# Altium project ECE453-F22-MCU.PrjPcb (part 2 of 2)

## Sheet StepperDriver.SchDoc
size A
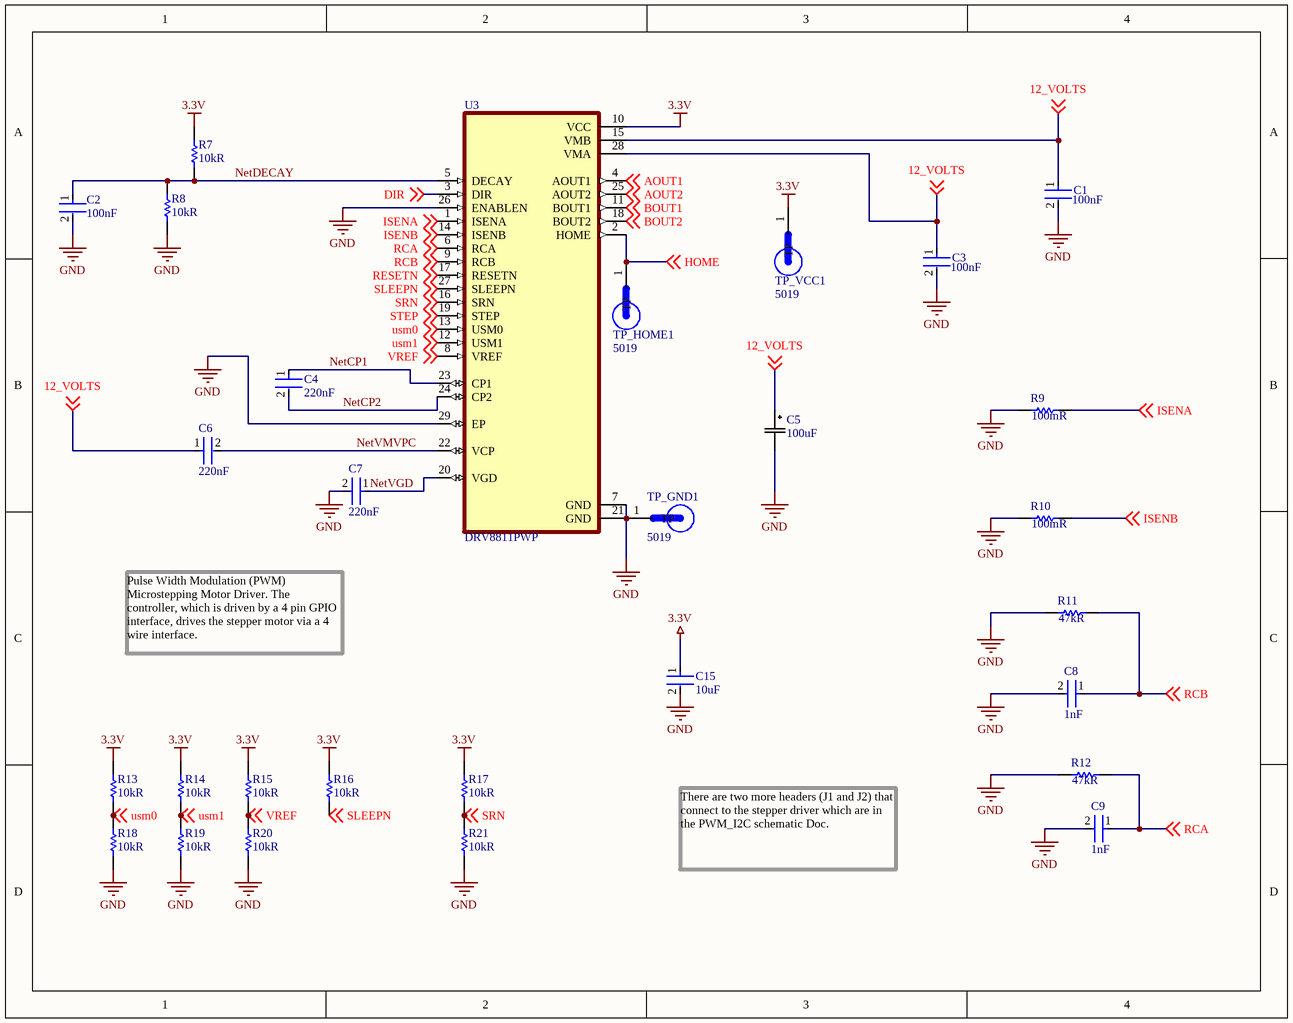
[diagram p3: StepperDriver.SchDoc]

### Parts
C1  Capacitance: 100nF  [FP-CL21-IPC_C]  (hidden comment: CL21B104KACNNNC)
C2  Capacitance: 100nF  [FP-CL21-IPC_C]  (hidden comment: CL21B104KACNNNC)
C3  Capacitance: 100nF  [FP-CL21-IPC_C]  (hidden comment: CL21B104KACNNNC)
C4  Capacitance: 220nF  [FP-0805-L_2_0_0_1-W_1_25-IPC_A]  (hidden comment: UMK212B7224KG-T)
C5  Capacitance: 100uF  [CAP_PC_8X7_NCH]  (hidden comment: PCV1D101MCL2GS)
C6  Capacitance: 220nF  [FP-0805-L_2_0_0_1-W_1_25-IPC_A]  (hidden comment: UMK212B7224KG-T)
C7  Capacitance: 220nF  [FP-0805-L_2_0_0_1-W_1_25-IPC_A]  (hidden comment: UMK212B7224KG-T)
C8  Capacitance: 1nF  [FP-0805-L_2_01_0_2-W_1_25-IPC_C]  (hidden comment: 08055C102KAT2A)
C9  Capacitance: 1nF  [FP-0805-L_2_01_0_2-W_1_25-IPC_C]  (hidden comment: 08055C102KAT2A)
C15  value 10uF  [FP-C0805C-DG-MFG]  (hidden comment: C0805C106K8PACTU)
R7  Resistance: 10kR  [RESC2013X60X35NL10T20]  (hidden comment: RC0805FR-0710KL)
R8  Resistance: 10kR  [RESC2013X60X35NL10T20]  (hidden comment: RC0805FR-0710KL)
R9  Resistance: 100mR  [RESC2013X65X35ML10T20]  (hidden comment: PT0805FR-7W0R1L)
R10  Resistance: 100mR  [RESC2013X65X35ML10T20]  (hidden comment: PT0805FR-7W0R1L)
R11  Resistance: 47kR  [RESC2013X70X40ML20T20]  (hidden comment: ERJ-6GEYJ473V)
R12  Resistance: 47kR  [RESC2013X70X40ML20T20]  (hidden comment: ERJ-6GEYJ473V)
R13  Resistance: 10kR  [RESC2013X60X35NL10T20]  (hidden comment: RC0805FR-0710KL)
R14  Resistance: 10kR  [RESC2013X60X35NL10T20]  (hidden comment: RC0805FR-0710KL)
R15  Resistance: 10kR  [RESC2013X60X35NL10T20]  (hidden comment: RC0805FR-0710KL)
R16  Resistance: 10kR  [RESC2013X60X35NL10T20]  (hidden comment: RC0805FR-0710KL)
R17  Resistance: 10kR  [RESC2013X60X35NL10T20]  (hidden comment: RC0805FR-0710KL)
R18  Resistance: 10kR  [RESC2013X60X35NL10T20]  (hidden comment: RC0805FR-0710KL)
R19  Resistance: 10kR  [RESC2013X60X35NL10T20]  (hidden comment: RC0805FR-0710KL)
R20  Resistance: 10kR  [RESC2013X60X35NL10T20]  (hidden comment: RC0805FR-0710KL)
R21  Resistance: 10kR  [RESC2013X60X35NL10T20]  (hidden comment: RC0805FR-0710KL)
TP_GND1  5019  [TP380X203]
TP_HOME1  5019  [TP380X203]
TP_VCC1  5019  [TP380X203]
U3  DRV8811PWP  [IC_TPS61196PWPRQ1]

### Nets
3.3V: C15.1 R7.2 R13.2 R14.2 R15.2 R16.2 R17.2 TP_VCC1.1(TP) U3.10(VCC)
GND: C1.2 C2.2 C3.2 C5.2 C7.2 C8.2 C9.2 C15.2 R8.1 R9.1 R10.1 R11.1 R12.1 R18.1 R19.1 R20.1 R21.1 TP_GND1.1(TP) U3.7(GND) U3.21(GND) U3.26(ENABLEN) U3.29(EP)
12_VOLTS: C1.1 C3.1 C5.1 C6.1 U3.15(VMB) U3.28(VMA) ; off-sheet 12_VOLTS
AOUT1: U3.4(AOUT1) ; off-sheet AOUT1
AOUT2: U3.25(AOUT2) ; off-sheet AOUT2
BOUT1: U3.11(BOUT1) ; off-sheet BOUT1
BOUT2: U3.18(BOUT2) ; off-sheet BOUT2
DIR: U3.3(DIR) ; off-sheet DIR
HOME: TP_HOME1.1(TP) U3.2(HOME) ; off-sheet HOME
ISENA: R9.2 U3.1(ISENA) ; off-sheet ISENA
ISENB: R10.2 U3.14(ISENB) ; off-sheet ISENB
NetCP1: C4.1 U3.23(CP1)
NetCP2: C4.2 U3.24(CP2)
NetDECAY: C2.1 R7.1 R8.2 U3.5(DECAY)
NetVGD: C7.1 U3.20(VGD)
NetVMVPC: C6.2 U3.22(VCP)
RCA: C9.1 R12.2 U3.6(RCA) ; off-sheet RCA
RCB: C8.1 R11.2 U3.9(RCB) ; off-sheet RCB
RESETN: U3.17(RESETN) ; off-sheet RESETN
SLEEPN: R16.1 U3.27(SLEEPN) ; off-sheet SLEEPN
SRN: R17.1 R21.2 U3.16(SRN) ; off-sheet SRN
STEP: U3.19(STEP) ; off-sheet STEP
usm0: R13.1 R18.2 U3.13(USM0) ; off-sheet usm0
usm1: R14.1 R19.2 U3.12(USM1) ; off-sheet usm1
VREF: R15.1 R20.2 U3.8(VREF) ; off-sheet VREF

### Notes on the sheet
- Pulse Width Modulation (PWM) Microstepping Motor Driver. The controller, which is driven by a 4 pin GPIO interface, drives the stepper motor via a 4 wire interface.
- There are two more headers (J1 and J2) that connect to the stepper driver which are in the PWM_I2C schematic Doc.

### Library data of the parts
C1-C3 = CMP-13271-002854-1: CL21 Series 0805 100nF 25V ±10% Tolerance X7R Multilayer Ceramic Chip Capacitor; Manufacturer: Samsung; Thickness: 0.037inch; Dielectric: X7R; Packaging: Tape and Reel; Height: 0.85mm; Case/Package: 0805; Mount: Surface Mount; Case Code (Imperial): 0805; Case Code (Metric): 2012; Length: 2mm; Voltage Rating: 25V; Voltage: 25V; Contact Plating: Tin; Tolerance: 10%; Max Operating Temperature: 125°C; Width: 0.049inch; Min Operating Temperature: -55°C; Radiation Hardening: No; Package Quantity: 1; Depth: 1.25mm; Supplier 1: Digi-Key; Supplier Part Number 1: 1276-1099-1-ND; Manufacturer Part Number: CL21B104KACNNNC; RoHS: Yes; Category: Ceramic Capacitors; Stock 1: 1473590; Pricing 1: 1=0.10000, 10=0.03700, 50=0.02020, 100=0.01650, 500=0.01178, 1000=0.00925 (USD); Series: CL; Construction: Flat; RoHS Compliant: Yes; ComponentLink1URL: https://datasheet.ciiva.com/25801/cl21b104kacnnnc-25801824.pdf?src-supplier=Digi-Key; ComponentLink1Description: https://datasheet.ciiva.com/25801/cl21b104kacnnnc-25801824.pdf?src-supplier=Digi-Key; ComponentLink2URL: https://datasheet.ciiva.com/15216/getdatasheetpartid-355204-15216236.pdf?src-supplier=Verical; ComponentLink2Description: https://datasheet.ciiva.com/15216/getdatasheetpartid-355204-15216236.pdf?src-supplier=Verical
C4 C6 C7 = CMP-14477-005057-2: Multilayer Ceramic Capacitor 0.22 uF 50V X7R 10% SMD 0805 T/R; Manufacturer: Taiyo Yuden; Voltage Rating: 50V; Width: 0.049inch; Series: M; Tolerance: 10%; Dielectric: X7R; Min Operating Temperature: -55°C; Mount: Surface Mount; Length: 2mm; RoHS Compliant: Yes; Radiation Hardening: No; Contact Plating: Nickel; Depth: 1.25mm; Case Code (Imperial): 0805; Height: 1.25mm; Construction: Flat; Case/Package: 0805; Thickness: 0.053inch; Voltage: 50V; Case Code (Metric): 2012; Halogen Free: Halogen Free; Termination: SMD/SMT; Package Quantity: 1; Max Operating Temperature: 125°C; Packaging: Tape and Reel; Voltage Rating (DC): 50V; Supplier 1: Digi-Key; Supplier Part Number 1: 587-1287-1-ND; Manufacturer Part Number: UMK212B7224KG-T; RoHS: Yes; Category: Ceramic Capacitors; Stock 1: 1309484; Pricing 1: 1=0.13000, 10=0.09300, 50=0.05300, 100=0.04390, 500=0.03080, 1000=0.02550 (USD); REACH SVHC: Unknown; ComponentLink1URL: https://datasheet.ciiva.com/133/umk212b7224kg-t-ss-133747.pdf?src-supplier=Digi-Key; ComponentLink1Description: https://datasheet.ciiva.com/133/umk212b7224kg-t-ss-133747.pdf?src-supplier=Digi-Key; ComponentLink2URL: https://datasheet.ciiva.com/30106/209umk212b7224kg-t-30106923.pdf?src-supplier=Onlinecomponents.com; ComponentLink2Description: https://datasheet.ciiva.com/30106/209umk212b7224kg-t-30106923.pdf?src-supplier=Onlinecomponents.com; ComponentLink3URL: https://datasheet.ciiva.com/15922/1134umk212b7224kg-t-15922643.pdf?src-supplier=Onlinecomponents.com; ComponentLink3Description: https://datasheet.ciiva.com/15922/1134umk212b7224kg-t-15922643.pdf?src-supplier=Onlinecomponents.com; ComponentLink4URL: https://datasheet.ciiva.com/15165/getdatasheetpartid-63436-15165368.pdf?src-supplier=Verical; ComponentLink4Description: https://datasheet.ciiva.com/15165/getdatasheetpartid-63436-15165368.pdf?src-supplier=Verical; ComponentLink5URL: https://datasheet.ciiva.com/30164/55umk212b7224kg-t-30164219.pdf?src-supplier=Onlinecomponents.com; ComponentLink5Description: https://datasheet.ciiva.com/30164/55umk212b7224kg-t-30164219.pdf?src-supplier=Onlinecomponents.com; ComponentLink6URL: https://datasheet.ciiva.com/28645/746258-28645309.pdf?src-supplier=Element14; ComponentLink6Description: https://datasheet.ciiva.com/28645/746258-28645309.pdf?src-supplier=Element14
C5 = PCV1D101MCL2GS: Cap Aluminum Polymer 100uF 20VDC 20% (8 X 7mm) SMD 0.042 Ohm 1400mA 3000h 105C Automotive T/R; Mfr_Name: Nichicon; Type: DEV; Voltage Rating (DC): 20V; ESR (Equivalent Series Resistance): 42mR; Ripple Current: 1.4A; Leakage Current: 400uA; Polarity: Polar; Dissipation Factor: 0.12%; Life (Hours): 3000Hour; Copyright: Copyright (C) 2022 Ultra Librarian. All rights reserved.; Manufacturer_Part_Number: PCV1D101MCL2GS; Digi-Key_Part_Number_1: 493-4532-1-ND; Digi-Key_Part_Number_2: 493-4532-2-ND; Digi-Key_Part_Number_3: 493-4532-6-ND; RefDes: RefDes; Supplier 1: Digi-Key; Supplier Part Number 1: 493-4532-1-ND; Manufacturer: Nichicon; Manufacturer Part Number: PCV1D101MCL2GS; RoHS: Yes; Category: Polymer Capacitors; Stock 1: 12604; Pricing 1: 1=2.46000, 10=1.99300, 50=1.73900, 100=1.52170, 500=1.15938 (USD); Mount: Surface Mount,PCB; Case/Package: Radial; Min Operating Temperature: -55°C; Max Operating Temperature: 105°C; Tolerance: 20%; Package Quantity: 1; Voltage Rating: 20V; Packaging: Tape and Reel; Termination: SMD/SMT; Voltage: 20V; Series: CV; Diameter: 8mm; Length: 7mm; Height: 7mm; Height - Seated (Max): 0.276inch; Lead Pitch: 3.2mm; RoHS Compliant: Yes; ComponentLink1URL: https://datasheet.ciiva.com/115/e-cv-115994.pdf?src-supplier=Digi-Key; ComponentLink1Description: https://datasheet.ciiva.com/115/e-cv-115994.pdf?src-supplier=Digi-Key; ComponentLink2URL: https://datasheet.ciiva.com/115/e-cv-115995.pdf?src-supplier=Digi-Key; ComponentLink2Description: https://datasheet.ciiva.com/115/e-cv-115995.pdf?src-supplier=Digi-Key; ComponentLink3URL: https://datasheet.ciiva.com/115/e-cv-115996.pdf?src-supplier=Digi-Key; ComponentLink3Description: https://datasheet.ciiva.com/115/e-cv-115996.pdf?src-supplier=Digi-Key
C8 C9 = CMP-1036-02979-3: General Purpose Ceramic Capacitor, 0805, 1nF, 10%, X7R, 0.15, 50V; Manufacturer: Kyocera AVX; Dissipation Factor: 2.5%; Insulation Resistance: 100GR; Radiation Hardening: No; Case Code (Imperial): 0805; Packaging: Tape and Reel; Height: 0.94mm; Number of Pins: 2; REACH SVHC: No SVHC; Case Code (Metric): 2012; Voltage: 50V; Max Operating Temperature: 125°C; Tolerance: 10%; Voltage Rating: 50V; Depth: 1.25mm; Voltage Rating (DC): 50V; Thickness: 0.037inch; Termination: SMD/SMT; Package Quantity: 1; RoHS Compliant: Yes; Mount: Surface Mount; Dielectric: X7R; Length: 2.01mm; Contact Plating: Tin; Lead Free: Lead Free; Case/Package: 0805; Width: 1.25mm; Dielectric Material: Ceramic; Min Operating Temperature: -55°C; Supplier 1: Digi-Key; Supplier Part Number 1: 478-1371-1-ND; Manufacturer Part Number: 08055C102KAT2A; RoHS: Yes; Category: Ceramic Capacitors; Stock 1: 651619; Pricing 1: 1=0.10000, 10=0.07300, 50=0.04000, 100=0.03270, 500=0.02334, 1000=0.01833 (USD); ComponentLink1URL: https://datasheet.ciiva.com/19476/2009543-19476290.pdf?src-supplier=Jameco; ComponentLink1Description: https://datasheet.ciiva.com/19476/2009543-19476290.pdf?src-supplier=Jameco; ComponentLink2URL: https://datasheet.ciiva.com/11786/0900766b802d4698-11786944.pdf?src-supplier=RSComponents; ComponentLink2Description: https://datasheet.ciiva.com/11786/0900766b802d4698-11786944.pdf?src-supplier=RSComponents; ComponentLink3URL: https://datasheet.ciiva.com/150/cx7r-150264.pdf?src-supplier=Digi-Key; ComponentLink3Description: https://datasheet.ciiva.com/150/cx7r-150264.pdf?src-supplier=Digi-Key; ComponentLink4URL: https://datasheet.ciiva.com/150/cx7r-150265.pdf?src-supplier=Digi-Key; ComponentLink4Description: https://datasheet.ciiva.com/150/cx7r-150265.pdf?src-supplier=Digi-Key
C15 = CMP-2007-03243-2: CAP CER 10UF 10V X5R 0805; Manufacturer: Kemet; 3DS Part Number: 220-00001; Tolerance: 10%; Temperature Coefficient: 15%; Material: Ceramic; Device Class L2: Capacitors; Device Class L1: Passive Components; ComponentLink2URL: https://content.kemet.com/datasheets/KEM_C1006_X5R_SMD.pdf; Height: 1.4mm; Lead Free: Yes; Manufacturer Part Number: C0805C106K8PACTU; Digikey Description: CAP CER 10UF 10V X5R 0805; Octopart: https://octopart.com/c0805c106k8pactu-kemet-98697; Capacitance: 10uF; Temperature Range Low: -55°C; Temperature: -55°C to +85°C; Automotive: No; Mouser Description: CAP CER 10UF 10V X5R 0805; Ipc Land Pattern Name: CAPC200125X125; Temperature Range High: +85°C; Voltage: 10V; RoHS: TRUE; Device Class L3: Ceramic Capacitors; ComponentLink2Description: Datasheet; Voltage Rating: 10V; Package: C0805C-DG; Temperature Characteristic: X5R; Category: Cap; Supplier 1: Digi-Key; Supplier Part Number 1: 399-C0805C106K8PAC7800CT-ND; Manufacturer 1: KEMET; Manufacturer Part Number 1: C0805C106K8PACTU; Stock 1: 8631846; Pricing 1: 1=0.14000, 10=0.10300, 50=0.05840, 100=0.04830, 500=0.03388, 1000=0.02805 (USD); Mount: Surface Mount; Case/Package: 0805; Number of Pins: 2; Case Code (Imperial): 0805; Case Code (Metric): 2012; Dielectric Material: Ceramic; Contact Plating: Tin,Matte; Min Operating Temperature: -55°C; Max Operating Temperature: 85°C; Packaging: Tape and Reel; Dielectric: X5R; Package Quantity: 1; Voltage Rating (DC): 10V; Series: C; Termination: SMD/SMT; Construction: Flat; Dissipation Factor: 10%; Length: 2mm; Width: 1.2mm; Depth: 1.25mm; Thickness: 0.055inch; Radiation Hardening: No; REACH SVHC: No SVHC; RoHS Compliant: Yes
R7 R8 R13-R21 = CMP-1659-00013-4: Chip Resistor, 10 KOhm, +/- 1%, 0.125 W, -55 to 155 degC, 0805 (2012 Metric), RoHS, Tape and Reel; Manufacturer: Yageo; Voltage Rating: 150 V; Power Rating: 125mW; Temperature Coefficient: 100ppm/°C; Mount: Surface Mount; ComponentLink1Description: Manufacturer URL; ComponentLink2URL: http://www.yageo.com/documents/recent/PYu-RC_Group_51_RoHS_L_04.pdf; Pins: 2; Length: 2 mm; Min Operating Temperature: -55 degC; Height: 0.5 mm; Mounting Technology: Surface Mount; RoHSCompliant: true; REACH SVHC: No SVHC; ComponentLink1URL: http://www.yageo.com/; Max Operating Temperature: 155 degC; PackageReference: 0805; DatasheetVersion: Rev. 4, 02/2016; Package Quantity: 5000; Packaging: Tape and Reel; ComponentLink2Description: Datasheet; PackageDescription: 2-Pin Surface Mounted Device, Body 2 x 1.25 mm; Supplier 1: Digi-Key; Supplier Part Number 1: 311-10.0KCRCT-ND; Manufacturer Part Number: RC0805FR-0710KL; RoHS: Yes; Category: Chip SMD Resistors; Stock 1: 5888109; Pricing 1: 1=0.10000, 10=0.03800, 100=0.01560, 1000=0.00702, 2500=0.00610 (USD); Case/Package: 0805; Case Code (Imperial): 0805; Case Code (Metric): 2012; Size Code: 0805; Tolerance: 1%; Termination: SMD/SMT; Series: RC; Resistance Tolerance: 1%; Max Power Dissipation: 125mW; Resistor Type: Thick Film; Number of Terminations: 2; Features: Moisture Resistant; Construction: Rectangular; Technology: THICK FILM; Width: 0.049inch; Depth: 1.25mm; RoHS Compliant: Yes; Lead Free: Lead Free; Military Standard: Not; ComponentLink3URL: https://datasheet.ciiva.com/11808/0900766b8106beab-11808151.pdf?src-supplier=RSComponents; ComponentLink3Description: https://datasheet.ciiva.com/11808/0900766b8106beab-11808151.pdf?src-supplier=RSComponents; ComponentLink4URL: https://datasheet.ciiva.com/46447/444164-46447563.pdf?src-supplier=Element14; ComponentLink4Description: https://datasheet.ciiva.com/46447/444164-46447563.pdf?src-supplier=Element14; ComponentLink5URL: https://datasheet.ciiva.com/2456/pyu-r-int-thick-7-2456973.pdf?src-supplier=Digi-Key; ComponentLink5Description: https://datasheet.ciiva.com/2456/pyu-r-int-thick-7-2456973.pdf?src-supplier=Digi-Key; ComponentLink6URL: https://datasheet.ciiva.com/2456/pyu-r-int-thick-7-2456974.pdf?src-supplier=Digi-Key; ComponentLink6Description: https://datasheet.ciiva.com/2456/pyu-r-int-thick-7-2456974.pdf?src-supplier=Digi-Key; ComponentLink7URL: https://datasheet.ciiva.com/2456/pyu-r-int-thick-7-2456972.pdf?src-supplier=Digi-Key; ComponentLink7Description: https://datasheet.ciiva.com/2456/pyu-r-int-thick-7-2456972.pdf?src-supplier=Digi-Key; ComponentLink8URL: https://datasheet.ciiva.com/12669/rc0805-12669688.pdf?src-supplier=Mouser; ComponentLink8Description: https://datasheet.ciiva.com/12669/rc0805-12669688.pdf?src-supplier=Mouser; ComponentLink9URL: https://datasheet.ciiva.com/16747/rc0805-16747087.pdf?src-supplier=Future+Electronics; ComponentLink9Description: https://datasheet.ciiva.com/16747/rc0805-16747087.pdf?src-supplier=Future+Electronics
R9 R10 = CMP-2001-04471-1: Manufacturer: Yageo; Tolerance: 1%; Max Power Dissipation: 250mW; Temperature Coefficient: 100ppm/°C; Part Number: PT0805FR-7W0R1L; Supplier 1: Newark; Supplier Part Number 1: 82AH7709; Manufacturer Part Number: PT0805FR-7W0R1L; RoHS: Yes; Category: Chip SMD Resistors; Stock 1: 80; Pricing 1: 1=0.10900, 10=0.10100, 25=0.09500, 50=0.08900, 100=0.08400 (USD); Case/Package: 0805; Case Code (Imperial): 0805; Case Code (Metric): 2012; Min Operating Temperature: -55°C; Max Operating Temperature: 155°C; Features: Moisture Resistant,Automotive AEC-Q200; Series: PT; Packaging: Tape and Reel; Number of Terminations: 2; Lead Free: Lead Free; RoHS Compliant: Yes; ComponentLink1URL: http://www.mouser.com/ds/2/447/yageodocoutput-1101729.pdf?src-supplier=Mouser; ComponentLink1Description: http://www.mouser.com/ds/2/447/yageodocoutput-1101729.pdf?src-supplier=Mouser; ComponentLink2URL: http://www.yageo.com/exep/pages/download/literatures/R-chip_current%20sensor_20140512.pdf?src-supplier=Digi-Key; ComponentLink2Description: http://www.yageo.com/exep/pages/download/literatures/R-chip_current%20sensor_20140512.pdf?src-supplier=Digi-Key
R11 R12 = CMP-2001-00421-1: Manufacturer: Panasonic; Tolerance: 5%; Temperature Coefficient: 200ppm/°C; Power Rating: 125mW; Voltage Rating: 150V; Part Number: ERJ-6GEYJ473V; Supplier 1: Digi-Key; Supplier Part Number 1: P47KACT-ND; Manufacturer Part Number: ERJ-6GEYJ473V; RoHS: Yes; Category: Chip SMD Resistors; Stock 1: 137402; Pricing 1: 1=0.10000, 10=0.06700, 100=0.02740, 1000=0.01230, 2500=0.01067 (USD); Mount: Surface Mount; Case/Package: 0805; Contact Plating: Tin; Case Code (Metric): 2012; Case Code (Imperial): 0805; Min Operating Temperature: -55°C; Max Operating Temperature: 155°C; Resistor Type: Thick Film; Packaging: Tape and Reel; Package Quantity: 1; Number of Terminations: 2; Termination: SMD/SMT; Max Power Dissipation: 125mW; Voltage Rating (DC): 150V; Series: ERJ; Construction: Rectangular; Technology: THICK FILM; Resistance Tolerance: 5%; Working Voltage: 150V; Features: Automotive AEC-Q200; Length: 2mm; Width: 0.049inch; Height: 0.6mm; Depth: 1.25mm; Radiation Hardening: No; REACH SVHC: No SVHC; Military Standard: Not; Lead Free: Lead Free; RoHS Compliant: Yes; ComponentLink1URL: https://datasheet.ciiva.com/11821/0900766b80f806dd-11821658.pdf?src-supplier=RSComponents; ComponentLink1Description: https://datasheet.ciiva.com/11821/0900766b80f806dd-11821658.pdf?src-supplier=RSComponents; ComponentLink2URL: https://datasheet.ciiva.com/43460/1500035-43460133.pdf?src-supplier=Farnell; ComponentLink2Description: https://datasheet.ciiva.com/43460/1500035-43460133.pdf?src-supplier=Farnell; ComponentLink3URL: https://datasheet.ciiva.com/46389/1500035-46389598.pdf?src-supplier=Element14; ComponentLink3Description: https://datasheet.ciiva.com/46389/1500035-46389598.pdf?src-supplier=Element14; ComponentLink4URL: https://datasheet.ciiva.com/6138/1500035-6138254.pdf?src-supplier=Farnell; ComponentLink4Description: https://datasheet.ciiva.com/6138/1500035-6138254.pdf?src-supplier=Farnell; ComponentLink5URL: https://datasheet.ciiva.com/46377/1500035-46377628.pdf?src-supplier=Element14; ComponentLink5Description: https://datasheet.ciiva.com/46377/1500035-46377628.pdf?src-supplier=Element14; ComponentLink6URL: https://datasheet.ciiva.com/28587/1678796-28587262.pdf?src-supplier=Element14; ComponentLink6Description: https://datasheet.ciiva.com/28587/1678796-28587262.pdf?src-supplier=Element14; ComponentLink7URL: https://datasheet.ciiva.com/24069/aoa0000ce1-37422-24069158.pdf?src-supplier=Mouser; ComponentLink7Description: https://datasheet.ciiva.com/24069/aoa0000ce1-37422-24069158.pdf?src-supplier=Mouser; ComponentLink8URL: https://datasheet.ciiva.com/9189/aoa0000ce1-9189350.pdf?src-supplier=Avnet; ComponentLink8Description: https://datasheet.ciiva.com/9189/aoa0000ce1-9189350.pdf?src-supplier=Avnet; ComponentLink9URL: https://datasheet.ciiva.com/16200/aoa0000ce1-16200503.pdf?src-supplier=Future+Electronics; ComponentLink9Description: https://datasheet.ciiva.com/16200/aoa0000ce1-16200503.pdf?src-supplier=Future+Electronics; ComponentLink10URL: https://datasheet.ciiva.com/48531/aoa0000ce1-48531646.pdf?src-supplier=Avnet; ComponentLink10Description: https://datasheet.ciiva.com/48531/aoa0000ce1-48531646.pdf?src-supplier=Avnet; ComponentLink11URL: https://datasheet.ciiva.com/30260/4aoa0000ce1-30260694.pdf?src-supplier=Onlinecomponents.com; ComponentLink11Description: https://datasheet.ciiva.com/30260/4aoa0000ce1-30260694.pdf?src-supplier=Onlinecomponents.com
TP_GND1 TP_HOME1 TP_VCC1 = 5019: PC Test Point, Miniature Phosphor Bronze, Silver Plating Surface Mount Mounting Type; MF: Keystone Electronics; Value: *; MP: 5019; Package: 2010 Keystone; SnapEDA_Link: https://www.snapeda.com/parts/5019/Keystone%20Electronics/view-part/449144/?ref=snap; Digi-Key_Part_Number: 36-5019CT-ND; Digi-Key_Purchase_URL: https://www.digikey.com/product-detail/en/keystone-electronics/5019/36-5019CT-ND/3907344?utm_source=snapeda&utm_medium=aggregator&utm_campaign=symbol
U3 = DRV8811PWP: 38-V, 1.9-A bipolar stepper motor driver with current regulation and 1/8 microstepping 28-HTSSOP -40 to 85; MF: Texas Instruments; SnapEDA_Link: https://www.snapeda.com/parts/DRV8811PWP/Texas%20Instruments/view-part/471965/?ref=snap; Availability: Good; Check_prices: https://www.snapeda.com/parts/DRV8811PWP/Texas%20Instruments/view-part/471965/?ref=eda; MP: DRV8811PWP; Price: None; Purchase-URL: https://pricing.snapeda.com/search/part/DRV8811PWP/?ref=eda; Package: HTSSOP-28 Texas Instruments; Value: *

## Sheet VoltageRegulator5V.SchDoc
size A
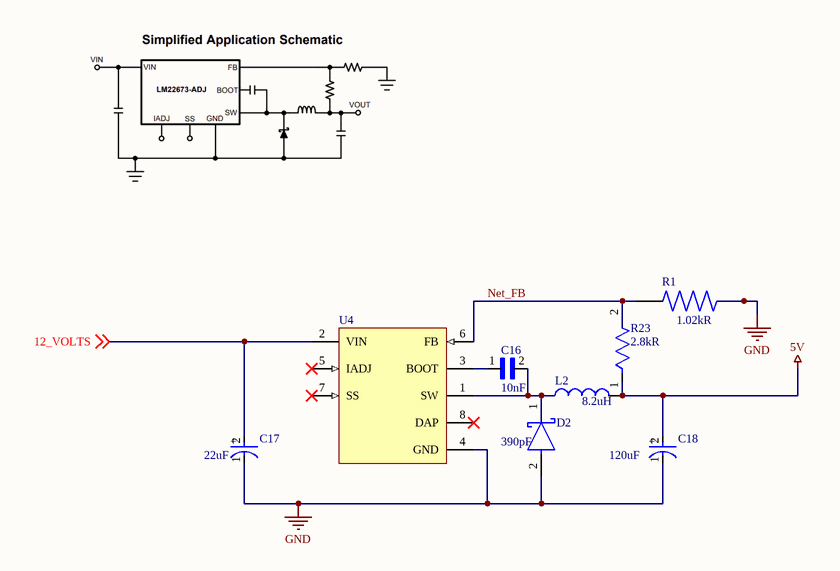
[diagram p4: VoltageRegulator5V.SchDoc]

### Parts
C16  value 10nF  [CAPC2012X100N]  (hidden comment: C0805C103F5GECAUTO)
C17  value 22uF  [FP-OS-CON-SMT-C6-MFG]  (hidden comment: 35SVF22M)
C18  Capacitance: 120uF  [FP-OS-CON-SMT-E7-MFG]  (hidden comment: 16SVPC120M)
D2  value 390pF  [FP-95401-MFG]  (hidden comment: VS-10BQ015-M3/5BT)
L2  value 8.2uH  [INDC2012X145N]  (hidden comment: CV201210-8R2K)
R1  Resistance: 1.02kR  [RESC2012X70N]  (hidden comment: ERJ-PB6B1021V)
R23  Resistance: 2.8kR  [FP-RNCP0805-MFG]  (hidden comment: RNCP0805FTD2K80)
U4  LM22673TJE-5.0/NOPB  [TJ7A_M]  (value not drawn)

### Nets
5V: C18.2(A) L2.2 R23.1
GND: C17.1(C) C18.1(C) D2.2(A) R1.2 U4.4(GND)
12_VOLTS: C17.2(A) U4.2(VIN) ; off-sheet 12_VOLTS
Net_FB: R1.1 R23.2 U4.6(FB)
NetC16_1: C16.1 U4.3(BOOT)
NetC16_2: C16.2 D2.1(C) L2.1 U4.1(SW)

Not connected (* = marked no-connect by the designer): U4 5(IADJ)* 7(SS)* 8(DAP)*

### Notes on the sheet
- (in symbol CMP-05428-000021-2) +
- (in symbol CMP-05428-000375-1) +

### Library data of the parts
C16 = C0805C103F5GECAUTO: CAP CER 0805 10NF 50V C0G 1%; Manufacturer: KEMET; Manufacturer Part Number: C0805C103F5GECAUTO7210; Package: None; Price: None; MP: C0805C103F5GECAUTO; Availability: Unavailable; Supplier 1: Digi-Key; Supplier Part Number 1: C0805C103F5GECAUTO7210-ND; RoHS: Yes; Category: Ceramic Capacitors; RoHS Compliant: Yes; ComponentLink1URL: https://api.kemet.com/component-edge/download/datasheet/C0805C103F5GECAUTO7210.pdf?src-supplier=Digi-Key; ComponentLink1Description: https://api.kemet.com/component-edge/download/datasheet/C0805C103F5GECAUTO7210.pdf?src-supplier=Digi-Key
C17 = CMP-05428-000375-1: Conductive Polymer Aluminum Solid Capacitors (OS-CON) 22uF ±20% 35V; Manufacturer: Panasonic; RoHS Compliant: Yes; Supplier 1: Arrow Electronics; Supplier Part Number 1: 35SVF22M; Manufacturer Part Number: 35SVF22M; RoHS: Yes; Category: Polymer Capacitors; Stock 1: 1750; Pricing 1: 1=0.96030, 10=0.87800, 25=0.85400, 100=0.76830, 250=0.76450, 500=0.65580, 1000=0.60660 (USD); ComponentLink1URL: http://www.farnell.com/datasheets/2283842.pdf?src-supplier=Farnell; ComponentLink1Description: http://www.farnell.com/datasheets/2283842.pdf?src-supplier=Farnell; ComponentLink2URL: https://na.industrial.panasonic.com/file-download/4311?src-supplier=Digi-Key; ComponentLink2Description: https://na.industrial.panasonic.com/file-download/4311?src-supplier=Digi-Key
C18 = CMP-05428-000021-2: Conductive Polymer Aluminum Solid Capacitors (OS-CON) 120uF ±20% 16V RADIAL SMT 8x6.9mm; Manufacturer: Panasonic; Leakage Current: 500uA; Ripple Current: 2.9A; ESR (Equivalent Series Resistance): 27mR; Polarity: Polar; Dissipation Factor: 12%; Life (Hours): 2000Hour; Lead Free: Lead Free; Voltage Rating (DC): 16V; Min Operating Temperature: -55°C; Height - Seated (Max): 0.276inch; Case/Package: Radial; REACH SVHC: No SVHC; Diameter: 8mm; Mount: Surface Mount; Package Quantity: 1000; Construction: Cylindrical; Max Operating Temperature: 105°C; Voltage: 16V; Length: 6.9mm; Tolerance: 20%; RoHS Compliant: Yes; Series: OS-CON, SVPC; Packaging: Tape and Reel; Voltage Rating: 16V; Termination: SMD/SMT; Number of Pins: 7; Ripple Current (AC): 2.9A; Height: 6.9mm; Supplier 1: RSComponents; Supplier Part Number 1: 7887618; Manufacturer Part Number: 16SVPC120M; RoHS: Yes; Category: Aluminum Electrolytic Capacitors; Stock 1: 1; Pricing 1: 2=1.66000, 10=1.54400, 20=1.42700, 50=1.19300, 100=1.02700 (USD); Reach SVHC Compliant: No; ComponentLink1URL: https://datasheet.ciiva.com/22746/1734358-22746176.pdf?src-supplier=Element14; ComponentLink1Description: https://datasheet.ciiva.com/22746/1734358-22746176.pdf?src-supplier=Element14; ComponentLink2URL: https://datasheet.ciiva.com/48542/svpc-eng-ds-48542359.pdf?src-supplier=Distrelec; ComponentLink2Description: https://datasheet.ciiva.com/48542/svpc-eng-ds-48542359.pdf?src-supplier=Distrelec; ComponentLink3URL: https://datasheet.ciiva.com/25740/1734358-25740810.pdf?src-supplier=Farnell; ComponentLink3Description: https://datasheet.ciiva.com/25740/1734358-25740810.pdf?src-supplier=Farnell
D2 = CMP-02539-000017-1: DIODE SCHOTTKY 15V 1A DO214AA; Manufacturer: Vishay; Standoff Height: 0mm; Max Surge Forward Current: 40A; Peak Reverse Current: 0.5mA; Max Junction Temp: +125°C; Max Reverse Current: 500uA; Max Forward Surge Current (Ifsm): 140A; Forward Voltage: 330mV; Element Configuration: Single; Max Repetitive Reverse Voltage: 15V; Mouser Description: VS-10BQ015 Series 15 V 1 A SMT Schottky Rectifier - SMB (DO-214AA); Device Class L1: Discrete Semiconductors; Height: 2.44mm; ComponentLink2Description: Datasheet; ComponentLink2URL: http://www.vishay.com/docs/93349/vs-10bq015m.pdf; Footprint Url: http://www.vishay.com/docs/95401/smb.pdf; Reverse Voltage: 15V; Device Class L2: Diodes; Package: 95401; Temperature Range High: +125°C; Manufacturer Part Number: VS-10BQ015-M3/5BT; Category: Diode; Device Class L3: Schottky Diodes; Temperature Range Low: -55°C; Capacitance: 390pF; RoHS: TRUE; Octopart: https://octopart.com/vs-10bq015-m3%2F5bt-vishay-39003459; Forward Current: 1A; Digikey Description: DIODE SCHOTTKY 15V 1A DO214AA; Temperature: -55°C to +125°C; Lead Free: Yes; Automotive: No; Supplier 1: RSComponents; Supplier Part Number 1: 5431601; Stock 1: 935; Pricing 1: 5=0.41200, 50=0.39000, 100=0.33000, 250=0.30800, 500=0.29000 (GBP); Mount: Surface Mount; Number of Pins: 2; Min Operating Temperature: -55°C; Max Operating Temperature: 125°C; Packaging: Tape and Reel; Average Rectified Current: 1A; Max Repetitive Reverse Voltage (Vrrm): 15V; Peak Non-Repetitive Surge Current: 140A; Max Reverse Voltage (DC): 15V; Length: 4.7mm; Width: 3.8mm; Reach SVHC Compliant: No; RoHS Compliant: Yes; ComponentLink1URL: http://uk.rs-online.com/webdocs/0791/0900766b8079100c.pdf?src-supplier=RSComponents; ComponentLink1Description: http://uk.rs-online.com/webdocs/0791/0900766b8079100c.pdf?src-supplier=RSComponents; ComponentLink3URL: http://www.mouser.com/ds/2/427/10bq015m-552901.pdf?src-supplier=Mouser; ComponentLink3Description: http://www.mouser.com/ds/2/427/10bq015m-552901.pdf?src-supplier=Mouser; ComponentLink4URL: https://media.digikey.com/pdf/Data%20Sheets/Vishay%20Semiconductors/VS-10BQ015-M3.pdf?src-supplier=Digi-Key; ComponentLink4Description: https://media.digikey.com/pdf/Data%20Sheets/Vishay%20Semiconductors/VS-10BQ015-M3.pdf?src-supplier=Digi-Key; ComponentLink5URL: http://www.produktinfo.conrad.com/datenblaetter/575000-599999/596658-da-01-en-DIODE_SCH_VS_10BQ015_M3_5BT_DO_214AA_VIS.pdf?src-supplier=Conrad; ComponentLink5Description: http://www.produktinfo.conrad.com/datenblaetter/575000-599999/596658-da-01-en-DIODE_SCH_VS_10BQ015_M3_5BT_DO_214AA_VIS.pdf?src-supplier=Conrad; ComponentLink6URL: http://www.farnell.com/datasheets/2085355.pdf?src-supplier=Element14; ComponentLink6Description: http://www.farnell.com/datasheets/2085355.pdf?src-supplier=Element14
L2 = CV201210-8R2K: Ind Chip Shielded Multi-Layer 8.2uH 10% 4MHz 45Q-Factor Ferrite 15mA 0805 T/R; Manufacturer: Bourns; DC Resistance (DCR): 1.1R; Self Resonant Frequency: 26MHz; Package: None; Price: None; MP: CV201210-8R2K; Availability: Unavailable; Supplier 1: Mouser; Supplier Part Number 1: 652-CV201210-8R2K; Manufacturer Part Number: CV201210-8R2K; RoHS: Yes; Category: Fixed Inductors; Stock 1: 12226; Pricing 1: 1=0.10000, 10=0.06300, 50=0.06300, 100=0.05100, 1000=0.03900, 10000=0.02900 (USD); Mount: Surface Mount; Case/Package: 0805; Core Material: Ferrite; Min Operating Temperature: -55°C; Max Operating Temperature: 125°C; Package Quantity: 2000; Packaging: Tape and Reel; Current Rating: 15mA; Tolerance: 10%; Shielding: Shielded; Inductance: 8.2uH; Termination: SMD/SMT; Test Frequency: 4MHz; Max DC Current: 15mA; Series: CV201210; Length: 0.079inch; Width: 1.25mm; Height: 1.25mm; Height - Seated (Max): 0.057inch; ComponentLink1URL: https://datasheet.ciiva.com/1067/cv201210-1067559.pdf?src-supplier=Digi-Key; ComponentLink1Description: https://datasheet.ciiva.com/1067/cv201210-1067559.pdf?src-supplier=Digi-Key; ComponentLink2URL: https://datasheet.ciiva.com/8516/cv201210-8516252.pdf?src-supplier=Avnet; ComponentLink2Description: https://datasheet.ciiva.com/8516/cv201210-8516252.pdf?src-supplier=Avnet
R1 = ERJ-PB6B1021V: Res SMD 1.02K Ohm 0.1% 1/4W 0805; Manufacturer: Panasonic; Max Power Dissipation: 250mW; Temperature Coefficient: 50ppm/°C; Package: None; Price: None; Value: *; MP: ERJ-PB6B1021V; Availability: Unavailable; Supplier 1: Arrow Electronics; Supplier Part Number 1: ERJ-PB6B1021V; Manufacturer Part Number: ERJ-PB6B1021V; RoHS: Yes; Category: Chip SMD Resistors; Stock 1: 4544; Pricing 1: 1=0.06400, 10=0.05410, 25=0.03880, 50=0.02800, 100=0.02780, 250=0.02750, 500=0.02730, 1000=0.02710, 3000=0.02690 (USD); Case/Package: 0805; Case Code (Metric): 2012; Case Code (Imperial): 0805; Min Operating Temperature: -55°C; Max Operating Temperature: 155°C; Packaging: Tape and Reel; Resistor Type: Thick Film; Number of Terminations: 2; Tolerance: 0.1%; Features: Automotive AEC-Q200; Length: 0.079inch; Width: 0.049inch; Height - Seated (Max): 0.028inch; ComponentLink1URL: https://industrial.panasonic.com/cdbs/www-data/pdf/RDM0000/DMM0000COL5.pdf?src-supplier=Digi-Key; ComponentLink1Description: https://industrial.panasonic.com/cdbs/www-data/pdf/RDM0000/DMM0000COL5.pdf?src-supplier=Digi-Key; ComponentLink2URL: https://industrial.panasonic.com/sa/system/files/data/download/catalog/id_fixed-resistors_e_2.pdf?src-supplier=Digi-Key; ComponentLink2Description: https://industrial.panasonic.com/sa/system/files/data/download/catalog/id_fixed-resistors_e_2.pdf?src-supplier=Digi-Key
R23 = CMP-26527-004404-1: 2.8kΩ ±1% 0.25W 0805 High Power Anti-Sulfur Thin Film Chip Resistor; Manufacturer: Stackpole Electronics; Max Power Dissipation: 250mW; Temperature Coefficient: 100ppm/°C; Case Code (Imperial): 0805; Height: 0.024inch; Mount: Surface Mount; Tolerance: 1%; Max Operating Temperature: 155°C; Packaging: Tape and Reel; Width: 0.049inch; Number of Terminations: 2; Case Code (Metric): 2012; Series: RNCP; Length: 0.079inch; Min Operating Temperature: -55°C; Resistor Type: Thin Film; RoHS Compliant: Yes; Case/Package: 0805; Features: Moisture Resistant; Supplier 1: Avnet; Supplier Part Number 1: RNCP0805FTD2K80; Manufacturer Part Number: RNCP0805FTD2K80; RoHS: Yes; Category: Chip SMD Resistors; Stock 1: 75000; Pricing 1: 25000=0.00682, 35000=0.00672, 60000=0.00653, 125000=0.00638, 250000=0.00614, 1250000=0.00600, 2500000=0.00586 (USD); ComponentLink1URL: http://www.seielect.com/Catalog/SEI-rncp.pdf?src-supplier=Digi-Key; ComponentLink1Description: http://www.seielect.com/Catalog/SEI-rncp.pdf?src-supplier=Digi-Key; ComponentLink2URL: https://www.seielect.com/catalog/SEI-Packaging.pdf?src-supplier=Digi-Key; ComponentLink2Description: https://www.seielect.com/catalog/SEI-Packaging.pdf?src-supplier=Digi-Key
U4 = CMP-0069-00312-2: 3A SIMPLE SWITCHER®, Step-Down Voltage Regulator with Adjustable Soft-Start and Current Limit, 7-pin TO-263 Thin, Pb-Free; Manufacturer: National Semiconductor; PackageTopMarking: NSUZXYTTE#*LM22673*TJ-5.0; PowerWise: N; Frequency: 500kHz; Max Input Voltage: 42V; Min Supply Voltage: 8V; Output Voltage: 5V; Number of Outputs: 1; Efficiency: 90%; Min Input Voltage: 4.5V; Synchronous Rectifier: No; Quiescent Current: 3.4mA; Output Type: Fixed; PinCount: 7; ComponentLink2Description: LM22673 Web Page; ComponentLink1URL: http://www.national.com/ds/LM/LM22673.pdf; ComponentLink3URL: http://www.national.com/packaging/folders/tj7a.html; PackageVersion: revC, Jan-2008; ComponentLink2URL: http://www.national.com/pf/LM/LM22673.html; CompType: Switcher; PackageReference: TJ7A; ComponentLink3Description: TJ7A Package Page; RoHS: Y; DatasheetVersion: Nov-2008; ComponentLink1Description: LM22673 Datasheet; RevisionNote: Component URLs added; PackageDescription: Thin TO-263, Molded, 9.85 x 10.16 x 2mm Body, 7 Lead, 1.27mm Pitch, Surface Mount; Supplier 1: Digi-Key; Supplier Part Number 1: LM22673TJE-5.0/NOPBCT-ND; Manufacturer Part Number: LM22673TJE-5.0/NOPB; Category: Voltage Regulators - Switching; Stock 1: 248; Pricing 1: 1=6.04000, 10=5.42100, 25=5.12520, 100=4.44200 (USD); Mount: Surface Mount; Case/Package: TO-263; Number of Pins: 7; Weight: 0.01lb; Contact Plating: Tin; Min Operating Temperature: -40°C; Max Operating Temperature: 125°C; Max Output Current: 3A; Max Supply Voltage: 42V; Output Current: 3A; Packaging: Tape and Reel; Switching Frequency: 500kHz; Package Quantity: 250; Nominal Output Voltage: 5V; Max Output Voltage: 5V; Termination: SMD/SMT; Series: SIMPLE SWITCHER®; Length: 10.16mm; Width: 9.85mm; Height: 2mm; Radiation Hardening: No; Reach SVHC Compliant: No SVHC; Lead Free: Lead Free; RoHS Compliant: Yes; ComponentLink4URL: https://datasheet.ciiva.com/7994/1808298-7994560.pdf?src-supplier=Element14; ComponentLink4Description: https://datasheet.ciiva.com/7994/1808298-7994560.pdf?src-supplier=Element14; ComponentLink5URL: https://datasheet.ciiva.com/25627/0900766b810fa302-25627441.pdf?src-supplier=RSComponents; ComponentLink5Description: https://datasheet.ciiva.com/25627/0900766b810fa302-25627441.pdf?src-supplier=RSComponents; ComponentLink6URL: https://datasheet.ciiva.com/6596/lm22673-6596911.pdf?src-supplier=Digi-Key; ComponentLink6Description: https://datasheet.ciiva.com/6596/lm22673-6596911.pdf?src-supplier=Digi-Key; ComponentLink7URL: https://datasheet.ciiva.com/6596/lm22673-6596909.pdf?src-supplier=Digi-Key; ComponentLink7Description: https://datasheet.ciiva.com/6596/lm22673-6596909.pdf?src-supplier=Digi-Key; ComponentLink8URL: https://datasheet.ciiva.com/3221/lm22673-3221549.pdf?src-supplier=Avnet; ComponentLink8Description: https://datasheet.ciiva.com/3221/lm22673-3221549.pdf?src-supplier=Avnet

## Sheet VoltageSupervisor3.3V_5V.SchDoc
size A
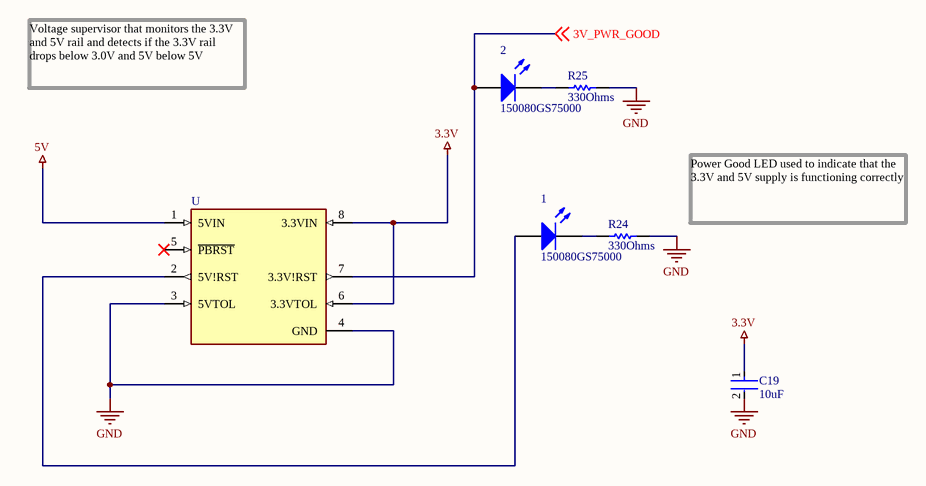
[diagram p5: VoltageSupervisor3.3V_5V.SchDoc]

### Parts
1  150080GS75000  [0805_A]
2  150080GS75000  [0805_A]
C19  value 10uF  [FP-C0805C-DG-MFG]  (hidden comment: C0805C106K8PACTU)
R24  Resistance: 330Ohms  [RESC2013X60X35LL10T20]  (hidden comment: RC0805FR-07330RL)
R25  Resistance: 330Ohms  [RESC2013X60X35LL10T20]  (hidden comment: RC0805FR-07330RL)
U  DS1834S+  [SOIC127P600X175-8N]  (value not drawn)

### Nets
3.3V: C19.1 U.6(3.3VTOL) U.8(3.3VIN)
5V: U.1(5VIN)
GND: C19.2 R24.1 R25.1 U.3(5VTOL) U.4(GND)
3V_PWR_GOOD: 2.2(A) U.7(3.3V!RST) ; off-sheet 3V_PWR_GOOD
Net1_1: 1.1(K) R24.2
Net1_2: 1.2(A) U.2(5V!RST)
Net2_1: 2.1(K) R25.2

Not connected (* = marked no-connect by the designer): U 5(~{PBRST})*

### Notes on the sheet
- Voltage supervisor that monitors the 3.3V and 5V rail and detects if the 3.3V rail drops below 3.0V and 5V below 5V
- Power Good LED used to indicate that the 3.3V and 5V supply is functioning correctly

### Library data of the parts
1 2 = CMP-1426-00007-1: SMD mono-color Chip LED, WL-SMCW, Green; Manufacturer: Wuerth Elektronik; Manufacturer 1: Wurth Electronics; Viewing Angle: 140°; Lens Style: Clear,Rectangular; Luminous Intensity: 450mcd; Forward Voltage: 3.2V; Wavelength: 520nm; Forward Current: 30mA; Test Current: 20mA; PackageReference: 0805_A; Color: Green; PartNumber: 150080GS75000; ComponentLink2URL: http://katalog.we-online.com/led/datasheet/150080GS75000.pdf; ComponentLink1URL: http://www.we-online.com; ComponentLink1Description: Manufacturer URL; ComponentLink2Description: Datasheet; Supplier 1: Digi-Key; Supplier Part Number 1: 732-4983-1-ND; Manufacturer Part Number 1: 150080GS75000; RoHS: Yes; Category: LEDs; Stock 1: 95801; Pricing 1: 1=0.19000, 50=0.17600, 100=0.15100, 500=0.13100 (USD); Mount: Surface Mount; Case/Package: 0805; Case Code (Metric): 2012; Case Code (Imperial): 0805; Min Operating Temperature: -40°C; Max Operating Temperature: 85°C; Package Quantity: 4000; Packaging: Cut Tape; Dominant Wavelength: 520nm; Length: 2mm; Width: 1.25mm; Height: 0.7mm; REACH SVHC: Unknown; RoHS Compliant: Yes; ComponentLink3URL: https://datasheet.ciiva.com/29563/150080gs75000-29563008.pdf?src-supplier=Digi-Key; ComponentLink3Description: https://datasheet.ciiva.com/29563/150080gs75000-29563008.pdf?src-supplier=Digi-Key; ComponentLink4URL: https://datasheet.ciiva.com/29279/759434-da-01-en-chipled-0805-w-kl-gruen-150080gs75000-29279039.pdf?src-supplier=Conrad; ComponentLink4Description: https://datasheet.ciiva.com/29279/759434-da-01-en-chipled-0805-w-kl-gruen-150080gs75000-29279039.pdf?src-supplier=Conrad
C19 = CMP-2007-03243-2: as C15 on sheet StepperDriver; Device Class L2: Capacitors; Device Class L1: Passive Components; ComponentLink2URL: https://content.kemet.com/datasheets/KEM_C1006_X5R_SMD.pdf; Height: 1.4mm; Lead Free: Yes; Manufacturer Part Number: C0805C106K8PACTU; Digikey Description: CAP CER 10UF 10V X5R 0805; Octopart: https://octopart.com/c0805c106k8pactu-kemet-98697; Capacitance: 10uF; Temperature Range Low: -55°C; Temperature: -55°C to +85°C; Automotive: No; Mouser Description: CAP CER 10UF 10V X5R 0805; Ipc Land Pattern Name: CAPC200125X125; Temperature Range High: +85°C; Voltage: 10V; RoHS: TRUE; Device Class L3: Ceramic Capacitors; ComponentLink2Description: Datasheet; Voltage Rating: 10V; Package: C0805C-DG; Temperature Characteristic: X5R; Category: Cap; Supplier 1: Digi-Key; Supplier Part Number 1: 399-C0805C106K8PAC7800CT-ND; Manufacturer 1: KEMET; Manufacturer Part Number 1: C0805C106K8PACTU; Stock 1: 8631846; Pricing 1: 1=0.14000, 10=0.10300, 50=0.05840, 100=0.04830, 500=0.03388, 1000=0.02805 (USD); Mount: Surface Mount; Case/Package: 0805; Number of Pins: 2; Case Code (Imperial): 0805; Case Code (Metric): 2012; Dielectric Material: Ceramic; Contact Plating: Tin,Matte; Min Operating Temperature: -55°C; Max Operating Temperature: 85°C; Packaging: Tape and Reel; Dielectric: X5R; Package Quantity: 1; Voltage Rating (DC): 10V; Series: C; Termination: SMD/SMT; Construction: Flat; Dissipation Factor: 10%; Length: 2mm; Width: 1.2mm; Depth: 1.25mm; Thickness: 0.055inch; Radiation Hardening: No; REACH SVHC: No SVHC; RoHS Compliant: Yes
R24 R25 = CMP-2000-06960-1: Chip Resistor, 330 Ohm, +/- 1%, 125 mW, -55 to 155 degC, 0805 (2012 Metric), RoHS, Tape and Reel; Manufacturer: Yageo; Voltage Rating: 150V; Temperature Coefficient: 100PPM/C; Power Rating: 125mW(1/8W); Max Power Dissipation: 125mW; Datasheet Version: Rev. 7, 05/2017; Termination Style: SMD/SMT; Case Code - mm: 2012; Package Description: 2-Pin Surface Mounted Device, Body 2 x 1.25 mm; Operating Temperature Range: -55Cto+155C; Case Code - in: 0805; Packaging: Reel; Tolerance: 1%; Package Reference: 0805; Mounting Technology: SurfaceMount; Product: ThickFilmResistorsGeneralPurpose; Series: RC; Manufacturer URL: http://www.yageo.com/; Datasheet URL: http://www.yageo.com/documents/recent/PYu-RC_Group_51_RoHS_L_7.pdf; Supplier 1: Digi-Key; Supplier Part Number 1: 311-330CRCT-ND; Manufacturer 1: Yageo; Manufacturer Part Number 1: RC0805FR-07330RL; RoHS: Yes; Category: Chip SMD Resistors; Stock 1: 1406392; Pricing 1: 1=0.10000, 10=0.03800, 100=0.01560, 1000=0.00699, 2500=0.00607 (USD); Case/Package: 0805; Case Code (Imperial): 0805; Case Code (Metric): 2012; Size Code: 0805; Min Operating Temperature: -55°C; Max Operating Temperature: 155°C; Package Quantity: 5000; Construction: Rectangular; Resistor Type: Thick Film; Number of Terminations: 2; Termination: SMD/SMT; Features: Moisture Resistant; Resistance Tolerance: 1%; Length: 2mm; Width: 0.049inch; Height: 0.024inch; Depth: 1.25mm; RoHS Compliant: Yes; Military Standard: Not; REACH SVHC: Unknown; Lead Free: Lead Free; ComponentLink1URL: https://datasheet.ciiva.com/2457/pyu-r-int-thick-7-2457015.pdf?src-supplier=Digi-Key; ComponentLink1Description: https://datasheet.ciiva.com/2457/pyu-r-int-thick-7-2457015.pdf?src-supplier=Digi-Key; ComponentLink2URL: https://datasheet.ciiva.com/2457/pyu-r-int-thick-7-2457016.pdf?src-supplier=Digi-Key; ComponentLink2Description: https://datasheet.ciiva.com/2457/pyu-r-int-thick-7-2457016.pdf?src-supplier=Digi-Key; ComponentLink3URL: https://datasheet.ciiva.com/2457/pyu-r-int-thick-7-2457014.pdf?src-supplier=Digi-Key; ComponentLink3Description: https://datasheet.ciiva.com/2457/pyu-r-int-thick-7-2457014.pdf?src-supplier=Digi-Key; ComponentLink4URL: https://datasheet.ciiva.com/12667/rc0805-12667925.pdf?src-supplier=Mouser; ComponentLink4Description: https://datasheet.ciiva.com/12667/rc0805-12667925.pdf?src-supplier=Mouser; ComponentLink5URL: https://datasheet.ciiva.com/7941/444164-7941768.pdf?src-supplier=Element14; ComponentLink5Description: https://datasheet.ciiva.com/7941/444164-7941768.pdf?src-supplier=Element14; ComponentLink6URL: https://datasheet.ciiva.com/7941/444164-7941769.pdf?src-supplier=Element14; ComponentLink6Description: https://datasheet.ciiva.com/7941/444164-7941769.pdf?src-supplier=Element14; ComponentLink7URL: https://datasheet.ciiva.com/16740/rc0805-16740975.pdf?src-supplier=Future+Electronics; ComponentLink7Description: https://datasheet.ciiva.com/16740/rc0805-16740975.pdf?src-supplier=Future+Electronics
U = DS1834S+: Processor Supervisor 4.63V/2.88V 3.3V/5V 8-Pin SOIC N; Manufacturer: Maxim; MF: Maxim Integrated; Min Supply Voltage: 1.2V; Max Supply Voltage: 5.5V; Number of Voltages Monitored: 2; Reset: Active Low; Overvoltage Threshold: 2.97V; Undervoltage Threshold: 2.8V; Operating Supply Current: 50uA; Watchdog Timer: No; Reset Timeout: 200ms; Threshold Voltage: 5V; Output: TOTEM-POLE; Max Reset Threshold Voltage: 3.3V; Min Reset Threshold Voltage: 2.5V; Value: *; Package: SOIC-8 Maxim; Price: None; MP: DS1834S+; Availability: Unavailable; SnapEDA_Link: https://www.snapeda.com/parts/DS1834S+/Maxim%20Integrated/view-part/1185071/?ref=snap; Supplier 1: Newark; Manufacturer Part Number: DS1834S+; RoHS: Yes; Category: Voltage Supervisors; Stock 1: 135; Pricing 1: 1=2.97000, 10=2.67000, 25=2.52000, 50=2.35000, 100=2.18000, 250=2.07000, 500=1.86000 (USD); Mount: Surface Mount; Case/Package: SOIC; Number of Pins: 8; Min Operating Temperature: -40°C; Max Operating Temperature: 85°C; Type: Multi-Voltage Supervisor,Monitor; Packaging: Rail/Tube; Max Supply Current: 50uA; Series: EconoReset; Package Quantity: 100; Nominal Supply Current: 50uA; Supply Current: 50uA; Length: 5mm; Width: 4mm; Height: 1.5mm; Radiation Hardening: No; Lead Free: Lead Free; RoHS Compliant: Yes; Reach SVHC Compliant: Unknown; ComponentLink1URL: https://datasheet.ciiva.com/14180/07377369-14180038.pdf?src-supplier=Distrelec; ComponentLink1Description: https://datasheet.ciiva.com/14180/07377369-14180038.pdf?src-supplier=Distrelec; ComponentLink2URL: https://datasheet.ciiva.com/1974/ds1834-ds1834d-1974710.pdf?src-supplier=Digi-Key; ComponentLink2Description: https://datasheet.ciiva.com/1974/ds1834-ds1834d-1974710.pdf?src-supplier=Digi-Key; ComponentLink3URL: https://datasheet.ciiva.com/14206/ds1834-ds1834d-14206072.pdf?src-supplier=Avnet; ComponentLink3Description: https://datasheet.ciiva.com/14206/ds1834-ds1834d-14206072.pdf?src-supplier=Avnet; ComponentLink4URL: https://datasheet.ciiva.com/14562/70127780-14562733.pdf?src-supplier=Allied+Electronics; ComponentLink4Description: https://datasheet.ciiva.com/14562/70127780-14562733.pdf?src-supplier=Allied+Electronics; Supplier 2: Digi-Key; Supplier 3: Digi-Key; Supplier Part Number 3: DS1834S+-ND

## Nets that join several sheets
3.3V: 02-MCU (12 pins), VoltageRegulator3.3V (C10.2 Co1.1 L1.2 U1.3), PWM_I2C (C12.1 C13.1 C14.1 P1.5), StepperDriver (9 pins), VoltageSupervisor3.3V_5V (C19.1 U.6 U.8)
5V: PWM_I2C (P2.5 P3.5), VoltageRegulator5V (C18.2 L2.2 R23.1), VoltageSupervisor3.3V_5V (U.1)
GND: 02-MCU (18 pins), VoltageRegulator3.3V (10 pins), PWM_I2C (7 pins), StepperDriver (22 pins), VoltageRegulator5V (5 pins), VoltageSupervisor3.3V_5V (5 pins)
VTARG: 02-MCU (D200.2 P200.1), PWM_I2C (R5.2 R6.2)
3V_PWR_GOOD: 02-MCU (U200.1), VoltageSupervisor3.3V_5V (2.2 U.7)
12_VOLTS: VoltageRegulator3.3V (Cin1.1 J3.1 U1.1), StepperDriver (6 pins), VoltageRegulator5V (C17.2 U4.2)
AOUT1: PWM_I2C (J2.1 TP_AOUT1.1), StepperDriver (U3.4)
AOUT2: PWM_I2C (J2.2 TP_AOUT2.1), StepperDriver (U3.25)
BOUT1: PWM_I2C (J2.3 TP_BOUT1.1), StepperDriver (U3.11)
BOUT2: PWM_I2C (J2.4 TP_BOUT2.1), StepperDriver (U3.18)
DIR: PWM_I2C (J1.2 TP_DIR1.1), StepperDriver (U3.3)
FIRING_SIGNAL: 02-MCU (MD200.25), PWM_I2C (U2.1)
HOME: PWM_I2C (J2.5 TP_HOME2.1), StepperDriver (TP_HOME1.1 U3.2)
P6_4: 02-MCU (MD200.24), PWM_I2C (P1.3 R6.1)
P6_5: 02-MCU (MD200.29), PWM_I2C (P1.4 R5.1)
PWM_SERVO1: 02-MCU (MD200.17), PWM_I2C (P2.4)
PWM_SERVO2: 02-MCU (MD200.21), PWM_I2C (P3.4)
RESETN: PWM_I2C (J1.1 TP_RST1.1), StepperDriver (U3.17)
STEP: PWM_I2C (J1.3 TP_STEP1.1), StepperDriver (U3.19)
XRES_N: 02-MCU (LED200.1 MD200.42 TP200.1 U201.4), PWM_I2C (J1.5)